# EasyEDA schematic picoschem.json
TITLE: Sheet_1; REV: 1.0; Date: 2024-08-30; Sheet: 1/1; Drawn By: Daniel; Company: Hack Club
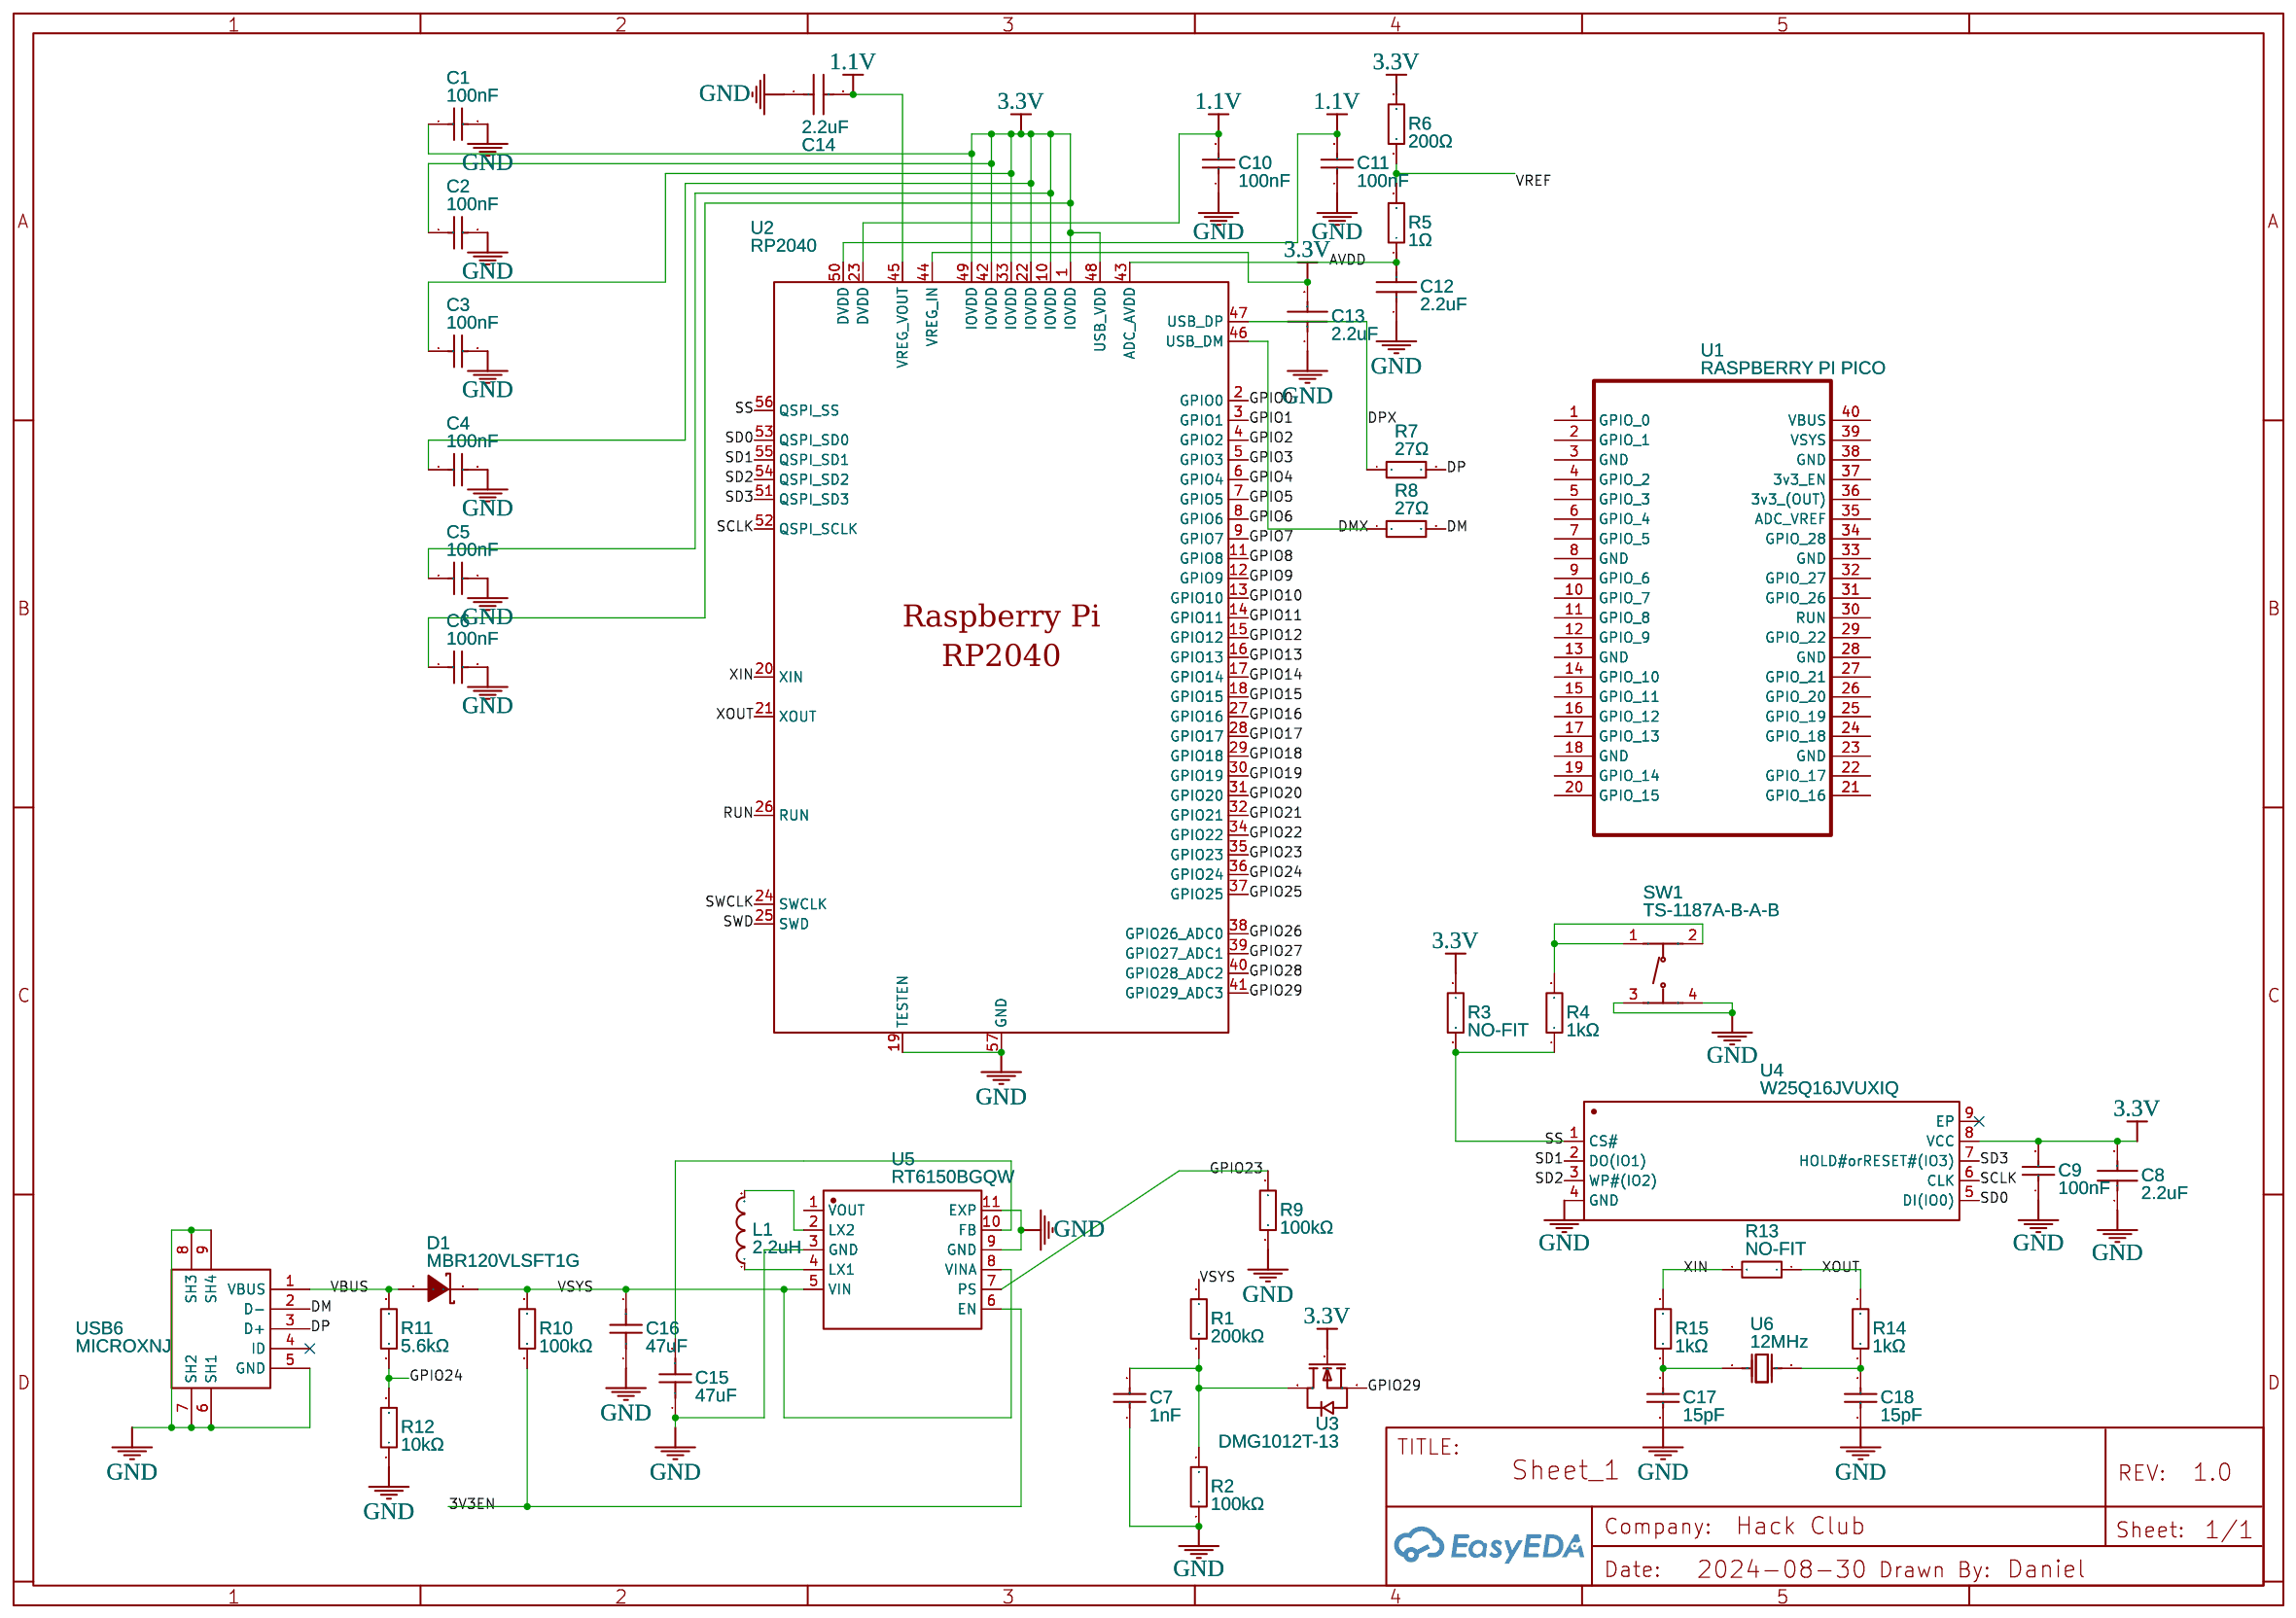
[diagram p0: schematic sheet]

## Parts
C1  100nF  [C0603]
C2  100nF  [C0603]
C3  100nF  [C0603]
C4  100nF  [C0603]
C5  100nF  [C0603]
C6  100nF  [C0603]
C7  1nF  [C0805]
C8  2.2uF  [C0402]
C9  100nF  [C0603]
C10  100nF  [C0603]
C11  100nF  [C0603]
C12  2.2uF  [C0402]
C13  2.2uF  [C0402]
C14  2.2uF  [C0402]
C15  47uF  [C0805]
C16  47uF  [C0805]
C17  15pF  [C0402]
C18  15pF  [C0402]
D1  MBR120VLSFT1G  [SOD-123F_L2.8-W1.8-LS3.7-RD]
L1  2.2uH  [L0805]
R1  200kΩ  [R0603]
R2  100kΩ  [R0603]
R3  NO-FIT  [R0603]
R4  1kΩ  [R0603]
R5  1Ω  [R0805]
R6  200Ω  [R0603]
R7  27Ω  [R0603]
R8  27Ω  [R0603]
R9  100kΩ  [R0603]
R10  100kΩ  [R0603]
R11  5.6kΩ  [R0805]
R12  10kΩ  [R0603]
R13  NO-FIT  [R0603]
R14  1kΩ  [R0603]
R15  1kΩ  [R0603]
SW1  TS-1187A-B-A-B  [SW-SMD_4P-L5.1-W5.1-P3.70-LS6.5-TL-2]
U1  RASPBERRY PI PICO  [RASPBERRY PI PICO/ RASPBERRY PI PICO W]
U2  RP2040  [LQFN-56_L7.0-W7.0-P0.4-EP]
U3  DMG1012T-13  [SOT-523-3_L1.6-W0.8-P1.00-LS1.6-BR]
U4  W25Q16JVUXIQ  [USON-8_L3.0-W2.0-P0.50-BL-EP]
U5  RT6150BGQW  [WSON-10_L2.5-W2.5-P0.50-BL-EP]
U6  12MHz  [CRYSTAL-SMD_L11.5-W4.8-LS12.7]
USB6  MICROXNJ  [MICRO-USB-SMD_MICROXNJ]

## Library data of the parts
C1-C6 C9-C11 = CGA3E2X7R1H104KT0Y0N: Supplier: LCSC; Manufacturer: TDK; Supplier Part: C76711
C7 = 0805CG102J500NT: Supplier: LCSC; Manufacturer: FH(风华); Supplier Part: C29925; JLCPCB Part Class: Extended Part
C8 C12-C14 = CL05A225MQ5NSNC: Supplier: LCSC; Manufacturer: SAMSUNG(三星); Supplier Part: C12530; JLCPCB Part Class: Basic Part
C15 C16 = CGA0805X5R476M100MT: Supplier: LCSC; Supplier Part: C6119904; Manufacturer: HRE(芯声); JLCPCB Part Class: Extended Part; Contributor: lcsc
C17 C18 = CC0402JRNPO9BN150: Supplier: LCSC; Manufacturer: YAGEO(国巨); Supplier Part: C106997; JLCPCB Part Class: Extended Part
D1 = MBR120VLSFT1G: Contributor: LCSC; Supplier: LCSC; Supplier Part: C223608; Manufacturer: onsemi(安森美); JLCPCB Part Class: Extended Part
L1 = CMI201209U2R2KT: Supplier: LCSC; Manufacturer: FH(风华); Supplier Part: C1043; JLCPCB Part Class: Extended Part
R1 R3 = 0603WAF2003T5E: Supplier: LCSC; Manufacturer: UNI-ROYAL(厚声); Supplier Part: C25811; JLCPCB Part Class: Basic Part
R2 R9 R10 = 0603WAF1003T5E: Supplier: LCSC; Manufacturer: UNI-ROYAL(厚声); Supplier Part: C25803; JLCPCB Part Class: Basic Part
R4 R13-R15 = 0603WAF1001T5E: Supplier: LCSC; Manufacturer: UNI-ROYAL(厚声); Supplier Part: C21190; JLCPCB Part Class: Basic Part
R5 = 0805W8F100KT5E: Supplier: LCSC; Manufacturer: UNI-ROYAL(厚声); Supplier Part: C25271; JLCPCB Part Class: Basic Part
R6 = 0603WAF2000T5E: Supplier: LCSC; Manufacturer: UNI-ROYAL(厚声); Supplier Part: C8218; JLCPCB Part Class: Basic Part
R7 R8 = 0603WAF270JT5E: Supplier: LCSC; Manufacturer: UNI-ROYAL(厚声); Supplier Part: C25190; JLCPCB Part Class: Extended Part
R11 = RM10FTN5601: Contributor: LCSC; Supplier: LCSC; Manufacturer: 大毅科技; Supplier Part: C147796; JLCPCB Part Class: Extended Part
R12 = 0603WAF1002T5E: Supplier: LCSC; Manufacturer: UNI-ROYAL(厚声); Supplier Part: C25804; JLCPCB Part Class: Basic Part
SW1 = TS-1187A-B-A-B: Contributor: LCSC; Supplier: LCSC; Supplier Part: C318884; Manufacturer: XKB Connectivity(中国星坤); JLCPCB Part Class: Basic Part
U1 = RASPBERRY PI PICO: Contributor: sunilgoud410
U2 = RP2040: Contributor: LCSC; Supplier: LCSC; Supplier Part: C2040; Manufacturer: Raspberry Pi(树莓派); JLCPCB Part Class: Extended Part
U3 = DMG1012T-13: Contributor: lcsc; Supplier: LCSC; Supplier Part: C3280264; Manufacturer: DIODES(美台); JLCPCB Part Class: Extended Part
U4 = W25Q16JVUXIQ: Contributor: lcsc; Supplier: LCSC; Supplier Part: C2843335; Manufacturer: WINBOND(华邦); JLCPCB Part Class: Extended Part
U5 = RT6150BGQW: Contributor: LCSC; Supplier: LCSC; Manufacturer: RICHTEK(立锜); Supplier Part: C147972; JLCPCB Part Class: Extended Part
U6 = ABLS-12.000MHZ-B4-T: Contributor: LCSC; Supplier: LCSC; Supplier Part: C596818; Manufacturer: ABRACON; JLCPCB Part Class: Extended Part
USB6 = MICROXNJ: Contributor: LCSC; Supplier: LCSC; Supplier Part: C404969; Manufacturer: SHOU HAN(首韩); Manufacturer Part: MicroXNJ; JLCPCB Part Class: Extended Part

## Nets
1.1V: C10.2 C11.2 C14.2 U2.23(DVDD) U2.45(VREG_VOUT) U2.50(DVDD)
3.3V: C1.1 C2.1 C3.1 C4.1 C5.1 C6.1 C8.2 C9.2 C13.2 R3.1 R6.2 U2.1(IOVDD) U2.10(IOVDD) U2.22(IOVDD) U2.33(IOVDD) U2.42(IOVDD) U2.44(VREG_IN) U2.48(USB_VDD) U2.49(IOVDD) U3.1(G) U4.8(VCC)
3V3EN: R10.1 U5.6(EN)
AVDD: C12.2 R5.1 U2.43(ADC_AVDD)
GND: C1.2 C2.2 C3.2 C4.2 C5.2 C6.2 C7.1 C8.1 C9.1 C10.1 C11.1 C12.1 C13.1 C14.1 C15.1 C16.1 C17.1 C18.1 R2.1 R9.1 R12.1 SW1.3(C) SW1.4(D) U2.19(TESTEN) U2.57(GND) U4.4(GND) U5.3(GND) U5.9(GND) U5.11(EXP) USB6.5(GND) USB6.6(SH1) USB6.7(SH2) USB6.8(SH3) USB6.9(SH4)
VBUS: D1.2(A) R11.2 USB6.1(VBUS)
DM: R8.2 USB6.2(D-)
DMX: R8.1 U2.46(USB_DM)
DP: R7.2 USB6.3(D+)
DPX: R7.1 U2.47(USB_DP)
GPIO0: U2.2(GPIO0)
GPIO1: U2.3(GPIO1)
GPIO2: U2.4(GPIO2)
GPIO3: U2.5(GPIO3)
GPIO4: U2.6(GPIO4)
GPIO5: U2.7(GPIO5)
GPIO6: U2.8(GPIO6)
GPIO7: U2.9(GPIO7)
GPIO8: U2.11(GPIO8)
GPIO9: U2.12(GPIO9)
GPIO10: U2.13(GPIO10)
GPIO11: U2.14(GPIO11)
GPIO12: U2.15(GPIO12)
GPIO13: U2.16(GPIO13)
GPIO14: U2.17(GPIO14)
GPIO15: U2.18(GPIO15)
GPIO16: U2.27(GPIO16)
GPIO17: U2.28(GPIO17)
GPIO18: U2.29(GPIO18)
GPIO19: U2.30(GPIO19)
GPIO20: U2.31(GPIO20)
GPIO21: U2.32(GPIO21)
GPIO22: U2.34(GPIO22)
GPIO23: R9.2 U2.35(GPIO23) U5.7(PS)
GPIO24: R11.1 R12.2 U2.36(GPIO24)
GPIO25: U2.37(GPIO25)
GPIO26: U2.38(GPIO26_ADC0)
GPIO27: U2.39(GPIO27_ADC1)
GPIO28: U2.40(GPIO28_ADC2)
GPIO29: U2.41(GPIO29_ADC3) U3.2(S)
RUN: U2.26(RUN)
SCLK: U2.52(QSPI_SCLK) U4.6(CLK)
SD0: U2.53(QSPI_SD0) U4.5(DI(IO0))
SD1: U2.55(QSPI_SD1) U4.2(DO(IO1))
SD2: U2.54(QSPI_SD2) U4.3(WP#(IO2))
SD3: U2.51(QSPI_SD3) U4.7(HOLD#orRESET#(IO3))
SS: R3.2 R4.1 U2.56(QSPI_SS) U4.1(CS#)
SWCLK: U2.24(SWCLK)
SWD: U2.25(SWD)
VSYS: C16.2 D1.1(K) R1.1 R10.2 U5.5(VIN) U5.8(VINA)
XIN: R13.2 R15.2 U2.20(XIN)
XOUT: R13.1 R14.2 U2.21(XOUT)
Net-(C7-2): C7.2 R1.2 R2.2 U3.3(D)
Net-(C15-2): C15.2 U5.10(FB)
Net-(C17-2): C17.2 R15.1 U6.1(OSC1)
Net-(C18-2): C18.2 R14.1 U6.2(OSC2)
Net-(L1-1): L1.1 U5.4(LX1)
Net-(L1-2): L1.2 U5.2(LX2)
Net-(R4-2): R4.2 SW1.1(A) SW1.2(B)
Net-(R5-2): R5.2 R6.1

Not connected (* = marked no-connect by the designer): U1 1(GPIO 0) 2(GPIO 1) 3(GND) 4(GPIO 2) 5(GPIO 3) 6(GPIO 4) 7(GPIO 5) 8(GND) 9(GPIO 6) 10(GPIO 7) 11(GPIO 8) 12(GPIO 9) 13(GND) 14(GPIO 10) 15(GPIO 11) 16(GPIO 12) 17(GPIO 13) 18(GND) 19(GPIO 14) 20(GPIO 15) 21(GPIO 16) 22(GPIO 17) 23(GND) 24(GPIO 18) 25(GPIO 19) 26(GPIO 20) 27(GPIO 21) 28(GND) 29(GPIO 22) 30(RUN) 31(GPIO 26) 32(GPIO 27) 33(GND) 34(GPIO 28) 35(ADC_VREF) 36(3v3 (OUT)) 37(3v3_EN) 38(GND) 39(VSYS) 40(VBUS); U4 9(EP)*; U5 1(VOUT); USB6 4(ID)*
